# Altium schematic sheet Peripherals.SchDoc: Wifi, LEDs and Push Button
size A4; Author: N.P; CompanyName: STMicroelectronics; Organization: MCD/APPLIS/LMS; DocumentNumber: MB1260; SheetNumber: 11; SheetTotal: 13; Project: STM32F723e-DISCO
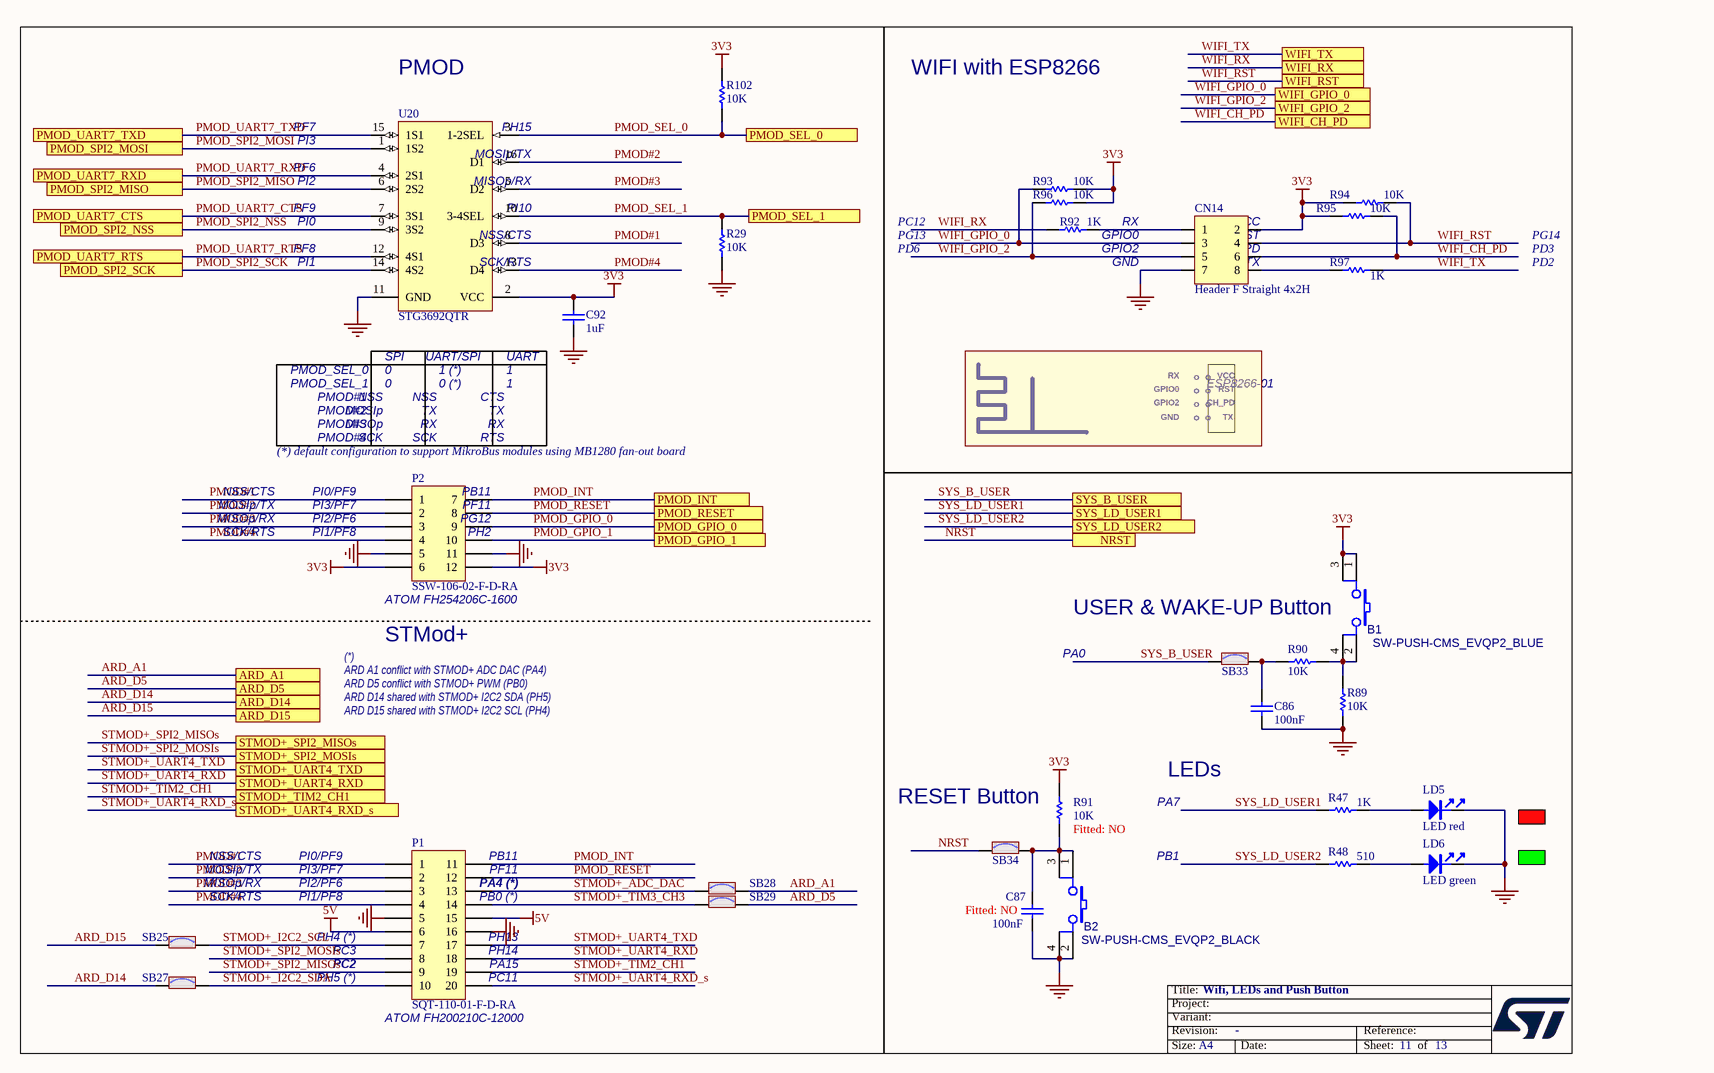
[diagram p0: Peripherals.SchDoc]

## Parts
B1  SW-PUSH-CMS_EVQP2_BLUE  [TACT_4SM_3R5X5R5]
B2  SW-PUSH-CMS_EVQP2_BLACK  [TACT_4SM_3R5X5R5]
C86  100nF  [0402C]
C87  100nF  Fitted: NO  [0402C]
C92  1uF  [0603C]
CN14  Header F Straight 4x2H  [HDR_2X4_2R54]
LD5  LED red  [0603D]
LD6  LED green  [0603D]
P1  SQT-110-01-F-D-RA  [SQT-110-01-F-D-RA]
P2  SSW-106-02-F-D-RA  [SSW-106-02-F-D-RA]
R29  10K  [0402R]
R47  value 1K  [0603R]  (hidden comment: 1K_1%_0603)
R48  value 510  [0603R]  (hidden comment: 510_1%_0603)
R89  10K  [0402R]
R90  10K  [0402R]
R91  Fitted: NO  [0402R]  (hidden comment: 10K)
R92  1K  [0402R]
R93  10K  [0402R]
R94  10K  [0402R]
R95  10K  [0402R]
R96  10K  [0402R]
R97  1K  [0402R]
R102  10K  [0402R]
SB25  Solder Bridge ON  [JP2_SMD]  (value not drawn)
SB27  Solder Bridge ON  [JP2_SMD]  (value not drawn)
SB28  Solder Bridge ON  [JP2_SMD]  (value not drawn)
SB29  Solder Bridge ON  [JP2_SMD]  (value not drawn)
SB33  Solder Bridge ON  [JP2_SMD]  (value not drawn)
SB34  Solder Bridge ON  [JP2_SMD]  (value not drawn)
U20  STG3692QTR  [QFN16_0R4_2R5X1R7]

## Ports
ARD_A1, ARD_D5, ARD_D14, ARD_D15, NRST, PMOD_GPIO_0, PMOD_GPIO_1, PMOD_INT, PMOD_RESET, PMOD_SEL_0, PMOD_SEL_1, PMOD_SPI2_MISO, PMOD_SPI2_MOSI, PMOD_SPI2_NSS, PMOD_SPI2_SCK, PMOD_UART7_CTS, PMOD_UART7_RTS, PMOD_UART7_RXD, PMOD_UART7_TXD, STMOD+_SPI2_MISOs, STMOD+_SPI2_MOSIs, STMOD+_TIM2_CH1, STMOD+_UART4_RXD, STMOD+_UART4_RXD_s, STMOD+_UART4_TXD, SYS_B_USER, SYS_LD_USER1, SYS_LD_USER2, WIFI_CH_PD, WIFI_GPIO_0, WIFI_GPIO_2, WIFI_RST, WIFI_RX, WIFI_TX

## Nets
3V3: B1.1 B1.3 C92.1 CN14.2 P2.6 P2.12 R91.2 R93.1 R94.1 R95.1 R96.1 R102.2 U20.2(VCC)
5V: P1.6 P1.15
GND: B2.2 B2.4 C86.1 C87.1 C92.2 CN14.7 LD5.2 LD6.2 P1.5 P1.16 P2.5 P2.11 R29.1 R89.1 U20.11(GND)
ARD_A1: SB28.2 ; port ARD_A1
ARD_D5: SB29.2 ; port ARD_D5
ARD_D14: SB27.1 ; port ARD_D14
ARD_D15: SB25.1 ; port ARD_D15
NRST: SB34.1 ; port NRST
PMOD#1: P1.1 P2.1 U20.8(D3)
PMOD#2: P1.2 P2.2 U20.16(D1)
PMOD#3: P1.3 P2.3 U20.5(D2)
PMOD#4: P1.4 P2.4 U20.13(D4)
PMOD_GPIO_0: P2.9 ; port PMOD_GPIO_0
PMOD_GPIO_1: P2.10 ; port PMOD_GPIO_1
PMOD_INT: P1.11 P2.7 ; port PMOD_INT
PMOD_RESET: P1.12 P2.8 ; port PMOD_RESET
PMOD_SEL_0: R102.1 U20.3(1-2SEL) ; port PMOD_SEL_0
PMOD_SEL_1: R29.2 U20.10(3-4SEL) ; port PMOD_SEL_1
PMOD_SPI2_MISO: U20.6(2S2) ; port PMOD_SPI2_MISO
PMOD_SPI2_MOSI: U20.1(1S2) ; port PMOD_SPI2_MOSI
PMOD_SPI2_NSS: U20.9(3S2) ; port PMOD_SPI2_NSS
PMOD_SPI2_SCK: U20.14(4S2) ; port PMOD_SPI2_SCK
PMOD_UART7_CTS: U20.7(3S1) ; port PMOD_UART7_CTS
PMOD_UART7_RTS: U20.12(4S1) ; port PMOD_UART7_RTS
PMOD_UART7_RXD: U20.4(2S1) ; port PMOD_UART7_RXD
PMOD_UART7_TXD: U20.15(1S1) ; port PMOD_UART7_TXD
STMOD+_ADC_DAC: P1.13 SB28.1
STMOD+_I2C2_SCL: P1.7 SB25.2
STMOD+_I2C2_SDA: P1.10 SB27.2
STMOD+_SPI2_MISOs: P1.9 ; port STMOD+_SPI2_MISOs
STMOD+_SPI2_MOSIs: P1.8 ; port STMOD+_SPI2_MOSIs
STMOD+_TIM2_CH1: P1.19 ; port STMOD+_TIM2_CH1
STMOD+_TIM3_CH3: P1.14 SB29.1
STMOD+_UART4_RXD: P1.18 ; port STMOD+_UART4_RXD
STMOD+_UART4_RXD_s: P1.20 ; port STMOD+_UART4_RXD_s
STMOD+_UART4_TXD: P1.17 ; port STMOD+_UART4_TXD
SYS_B_USER: SB33.1 ; port SYS_B_USER
SYS_LD_USER1: R47.1 ; port SYS_LD_USER1
SYS_LD_USER2: R48.1 ; port SYS_LD_USER2
WIFI_CH_PD: CN14.6 R95.2 ; port WIFI_CH_PD
WIFI_GPIO_0: CN14.3 R93.2 ; port WIFI_GPIO_0
WIFI_GPIO_2: CN14.5 R96.2 ; port WIFI_GPIO_2
WIFI_RST: CN14.4 R94.2 ; port WIFI_RST
WIFI_RX: R92.1 ; port WIFI_RX
WIFI_TX: R97.2 ; port WIFI_TX
NetB1_2: B1.2 B1.4 R89.2 R90.2
NetB2_1: B2.1 B2.3 C87.2 R91.1 SB34.2
NetC86_2: C86.2 R90.1 SB33.2
NetCN14_1: CN14.1 R92.2
NetCN14_8: CN14.8 R97.1
NetLD5_1: LD5.1 R47.2
NetLD6_1: LD6.1 R48.2

## Notes on the sheet
- PF7
- PMOD
- (near U20) PH15
- WIFI with ESP8266
- PI3
- PF6
- PI2
- (near U20) MOSIp/TX
- (near U20) MISOp/RX
- PF9
- PI1
- PI0
- PF8
- (near U20) PI10
- (near U20) NSS/CTS
- SCK/RTS
- PC12
- PG13
- PD6
- (near CN14) GND
- (near CN14) GPIO2
- (near CN14) GPIO0
- RX
- (near CN14) VCC
- (near CN14) CH_PD
- (near CN14) RST
- (near CN14) TX
- PG14
- PD3
- PD2
- PMOD_SEL_0
- PMOD_SEL_1
- PMOD#1
- 0
- NSS
- SPI
- UART/SPI
- 0 (*)
- 1 (*)
- CTS
- UART
- 1
- GPIO2
- GPIO0
- ° °
- VCC
- CH_PD
- RST
- ESP8266-01
- (near P2) (*) default configuration to support MikroBus modules using MB1280 fan-out board
- PMOD#2
- PMOD#3
- PMOD#4
- MOSIp
- MISOp
- SCK
- TX
- RTS
- GND
- NSS/CTS
- MOSIp/TX
- MISOp/RX
- (near P2) PI0/PF9
- (near P2) PI3/PF7
- (near P2) PI2/PF6
- (near P2) PI1/PF8
- (near P2) PB11
- (near P2) PF11
- (near P2) PG12
- (near P2) PH2
- (near P2) ATOM FH254206C-1600
- STMod+
- USER & WAKE-UP Button
- PA0
- (*)
  ARD A1 conflict with STMOD+ ADC DAC (PA4)
  ARD D5 conflict with STMOD+ PWM (PB0)
  ARD D14 shared with STMOD+ I2C2 SDA (PH5)
  ARD D15 shared with STMOD+ I2C2 SCL (PH4)
- RESET Button
- LEDs
- PA7
- (near P1) PI0/PF9
- (near P1) PI3/PF7
- PB11
- PF11
- PB1
- (near P1) PI2/PF6
- (near P1) PI1/PF8
- (near P1) PH4 (*)
- PA4 (*)
- PB0 (*)
- PH13
- (near P1) PC3
- (near P1) PC2
- (near P1) PH5 (*)
- PH14
- PA15
- PC11
- (near P1) ATOM FH200210C-12000
- Title:
- Project:
- Size:
- Revision:
- Variant:
- A4
- -
- Date:
- Reference:
- Sheet:
- of

## Library data of the parts
B1 = SW-PUSH-CMS_EVQP2_BLUE: EVQP2 - 4.7mm x 3.5 mm SMD Light Touch Switch; Manuf_2: Panasonic; Manuf_Part_2: EVQP2B02B; Manuf_Part_1: C-TS-02H-2.5-B-V-T/R; Manuf_1: Jiubaba; Ordered by: Subcon; Fitted: YES; ECCN_US/EU: n/a
B2 = SW-PUSH-CMS_EVQP2_BLACK: EVQP2 - 4.7mm x 3.5 mm SMD Light Touch Switch; Manuf_2: Panasonic; Manuf_Part_2: EVQP2F02K; Manuf_1: Jiubaba; Manuf_Part_1: C-TS-02H-2.5-K-V-T/R; Ordered by: Subcon; Fitted: YES; ECCN_US/EU: n/a
C86 = Cap_100nF_X7R_10%_0402: Capacitor,100nF,16V,X7R,10%,0402,YAGEO; Manuf_Part_1: CC0402KRX7R7BB104; Ordered by: Subcon; Fitted: YES; Revision: July-2002: Re-released for DXP Platform.; Value: 100nF; Order: CC0402KRX7R7BB104; Manuf_1: YAGEO; ECCN_US/EU: n/a
C87 = Cap_100nF_X7R_10%_0402: Capacitor,100nF,16V,X7R,10%,0402,YAGEO; Manuf_Part_1: CC0402KRX7R7BB104; Ordered by: Subcon; Revision: July-2002: Re-released for DXP Platform.; Value: 100nF; Order: CC0402KRX7R7BB104; Manuf_1: YAGEO; ECCN_US/EU: n/a
C92 = Cap_1uF_X5R_10%_0603: Capacitor,1uF,16V,X5R,10%,0603,YAGEO; Manuf_Part_1: CC0603KRX5R7BB105; Ordered by: Subcon; Fitted: YES; Revision: July-2002: Re-released for DXP Platform.; Value: 1uF; Order: CC0603KRX5R7BB105; Manuf_1: YAGEO; ECCN_US/EU: n/a
CN14 = Header 4X2F: Header Female, 4-Pin, Dual row, Straight; Manuf_Part_1: BL 2-8G; Manuf_1: Fischer Electronik; Fitted: YES; Ordered by: Subcon; Distrib: Sub Co; Footprint: HDR2X4H; ECCN_US/EU: n/a
LD5 = LED_red: LED red 0603; Manuf_1: everlight; Manuf_Part_1: 19-213-R6C-AP1Q2B/3T; Ordered by: Subcon; Fitted: YES; Order: 19-213-R6C-AP1Q2B/3T; ECCN_US/EU: n/a
LD6 = LED_green: LED green 0603; Manuf_1: everlight; Manuf_Part_1: 19-213SYGC/S530-E2/TR8; Ordered by: Subcon; Fitted: YES; Order: 19-213SYGC/S530-E2/TR8; ECCN_US/EU: n/a
P1 = Header 10X2 TH RA 2mm: 20 Position Receptacle Connector 0.079" (2.00mm) Through Hole Right Angle; Manuf_1: Samtec; Manuf_2: ATOM; Manuf_Part_2: FH200210C-12000; Ordered by: Subcon; Fitted: YES; Manuf_Part_1: SQT-110-01-F-D-RA; Order: SQT-110-01-F-D-RA; Value: SQT-110-01-F-D-RA; ECCN_US/EU: n/a
P2 = Header 6X2 TH RA 2.54mm: 12 Position Receptacle Connector 0.100" (2.54mm) Through Hole Right Angle; Manuf_1: Samtec; Manuf_2: ATOM; Manuf_Part_2: FH254206C-1600; Ordered by: Subcon; Fitted: YES; Manuf_Part_1: SSW-106-02-F-D-RA; Order: SSW-106-02-F-D-RA; Value: SSW-106-02-F-D-RA; ECCN_US/EU: n/a
R29 R89 R90 R93-R96 R102 = Res_10K_1%_0402: Resistor,10K,0402,1%,YAGEO; Manuf_Part_1: RC0402FR-0710KL; Ordered by: Subcon; Fitted: YES; Value: 10K; Manuf_1: YAGEO; Order: RC0402FR-0710KL; ECCN_US/EU: n/a
R47 = Res_1K_1%_0603: Resistor,1K,0603,1%,YAGEO; Manuf_Part_1: RC0603FR-071KL; Ordered by: Subcon; Fitted: YES; Manuf_1: YAGEO; Order: RC0603FR-071KL; ECCN_US/EU: n/a
R48 = Res_510_1%_0603: Resistor,510,0603,1%,YAGEO; Manuf_Part_1: RC0603FR-07510RL; Manuf_Part_2: RT0603FRE07510RL; Ordered by: Subcon; Fitted: YES; ECCN_US/EU: n/a; Manuf_1: YAGEO; Distrib: FARNELL; Manuf_2: YAGEO
R91 = Res_10K_1%_0402: Resistor,10K,0402,1%,YAGEO; Manuf_Part_1: RC0402FR-0710KL; Ordered by: Subcon; Value: 10K; Manuf_1: YAGEO; Order: RC0402FR-0710KL; ECCN_US/EU: n/a
R92 R97 = Res_1K_1%_0402: Resistor,1K,0402,1%,YAGEO; Manuf_Part_1: RC0402FR-071KL; Ordered by: Subcon; Fitted: YES; Value: 1K; Manuf_1: YAGEO; Order: RC0402FR-071KL; ECCN_US/EU: n/a
SB25 SB27-SB29 SB33 SB34 = SB_ON: Fitted: YES; Ordered by: Subcon; Revision: July-2002: Re-released for DXP Platform.; ECCN_US/EU: n/a
U20 = STG3692QTR: Low voltage high bandwidth quad SPDT switch; Manuf_1: STM; Fitted: YES; ECCN_US/EU: EAR99/NEC; Ordered by: ST; Manuf_Part_1: STG3692QTR; Value: STG3692QTR